# Altium schematic sheet Mechanical.SchDoc: Mechanical
size A; Organization: UCLA High Energy Physics; DocumentNumber: 23; Revision: 2.0; SheetNumber: 23; SheetTotal: 23; CurrentDate: 9/6/2018; ModifiedDate: 9/6/2018; ProjectName: ALCT S-6 Optical Mezzanine
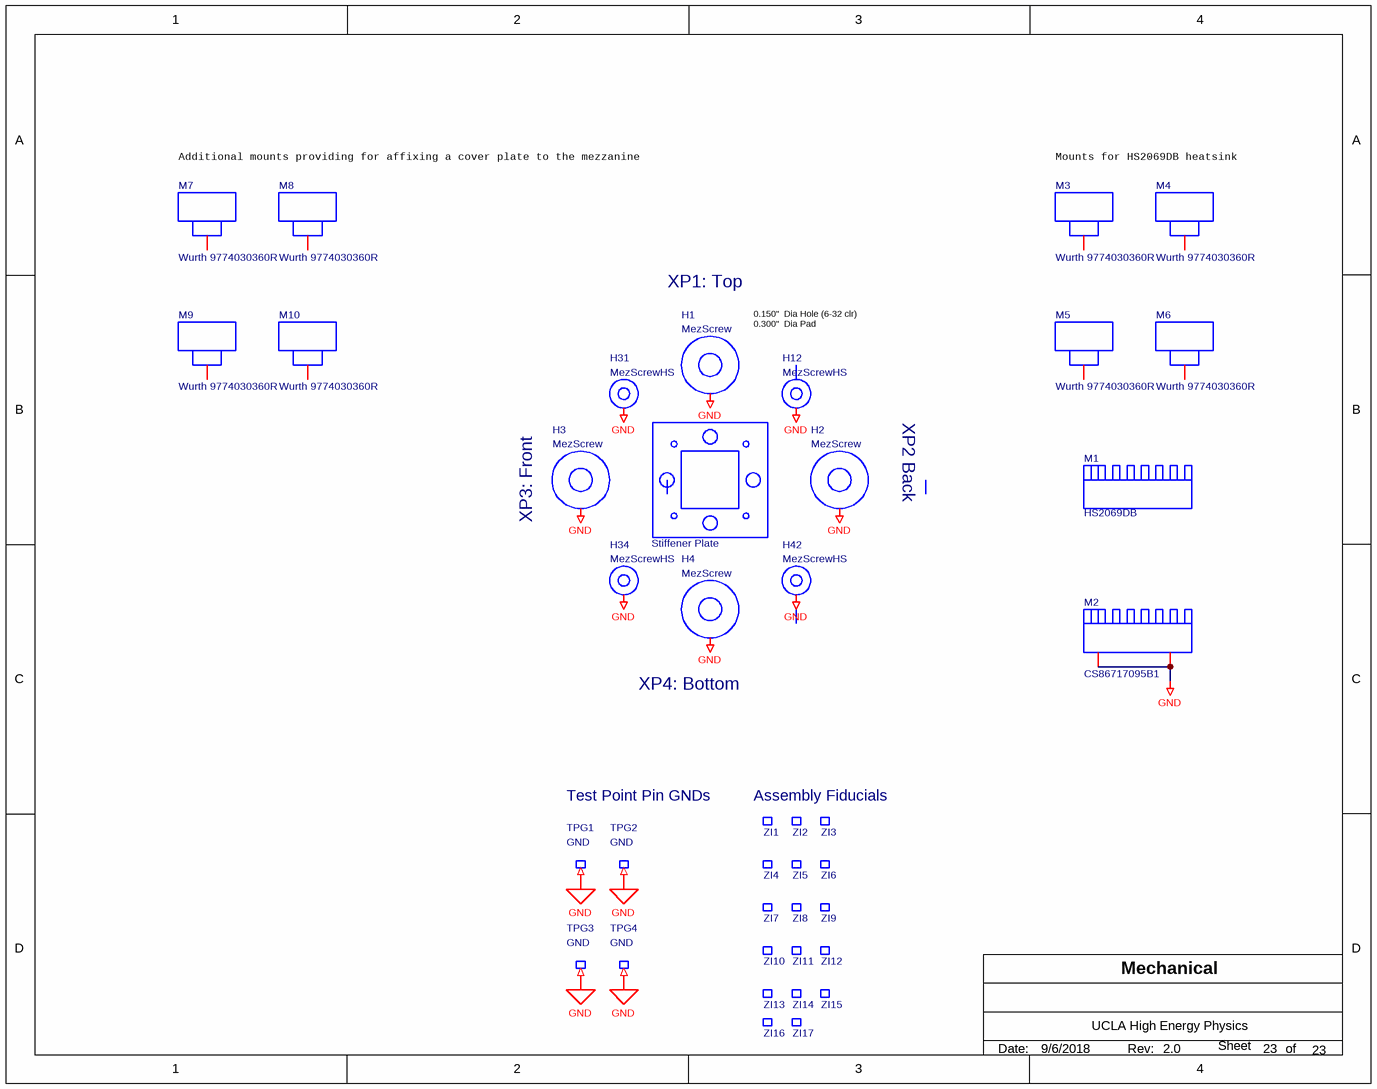
[diagram p0: Mechanical.SchDoc]

## Parts
H1  MezScrew  [MC_S6/TH/SCREW_BASE]  (no BOM)
H2  MezScrew  [MC_S6/TH/SCREW_BASE]  (no BOM)
H3  MezScrew  [MC_S6/TH/SCREW_BASE]  (no BOM)
H4  MezScrew  [MC_S6/TH/SCREW_BASE]  (no BOM)
H12  MezScrewHS  [MC_S6/TH/SCREW_PLATE]  (no BOM)
H31  MezScrewHS  [MC_S6/TH/SCREW_PLATE]  (no BOM)
H34  MezScrewHS  [MC_S6/TH/SCREW_PLATE]  (no BOM)
H42  MezScrewHS  [MC_S6/TH/SCREW_PLATE]  (no BOM)
M1  HS2069DB  [HS2069DB]  (no BOM)
M2  CS86717095B1  [CS86717095B1]  (no BOM)
M3  Wurth 9774030360R  [Wurth/9774020360R]
M4  Wurth 9774030360R  [Wurth/9774020360R]
M5  Wurth 9774030360R  [Wurth/9774020360R]
M6  Wurth 9774030360R  [Wurth/9774020360R]
M7  Wurth 9774030360R  [Wurth/9774020360R]
M8  Wurth 9774030360R  [Wurth/9774020360R]
M9  Wurth 9774030360R  [Wurth/9774020360R]
M10  Wurth 9774030360R  [Wurth/9774020360R]
SP1  Stiffener Plate  [MC_S6/SPLATE]  (no BOM)
TPG1  GND  [MC_S6/TH/TPGND]  (no BOM)
TPG2  GND  [MC_S6/TH/TPGND]  (no BOM)
TPG3  GND  [MC_S6/TH/TPGND]  (no BOM)
TPG4  GND  [MC_S6/TH/TPGND]  (no BOM)
ZI1  Fiducial Dot  [MC_S6/SM/FIDUCIAL_DOT]  (value not drawn)  (no BOM)
ZI2  Fiducial Dot  [MC_S6/SM/FIDUCIAL_DOT]  (value not drawn)  (no BOM)
ZI3  Fiducial Dot  [MC_S6/SM/FIDUCIAL_DOT]  (value not drawn)  (no BOM)
ZI4  Fiducial Dot  [MC_S6/SM/FIDUCIAL_DOT]  (value not drawn)  (no BOM)
ZI5  Fiducial Dot  [MC_S6/SM/FIDUCIAL_DOT]  (value not drawn)  (no BOM)
ZI6  Fiducial Dot  [MC_S6/SM/FIDUCIAL_DOT]  (value not drawn)  (no BOM)
ZI7  Fiducial Dot  [MC_S6/SM/FIDUCIAL_DOT]  (value not drawn)  (no BOM)
ZI8  Fiducial Dot  [MC_S6/SM/FIDUCIAL_DOT]  (value not drawn)  (no BOM)
ZI9  Fiducial Dot  [MC_S6/SM/FIDUCIAL_DOT]  (value not drawn)  (no BOM)
ZI10  Fiducial Dot  [MC_S6/SM/FIDUCIAL_DOT]  (value not drawn)  (no BOM)
ZI11  Fiducial Dot  [MC_S6/SM/FIDUCIAL_DOT]  (value not drawn)  (no BOM)
ZI12  Fiducial Dot  [MC_S6/SM/FIDUCIAL_DOT]  (value not drawn)  (no BOM)
ZI13  Fiducial Dot  [MC_S6/SM/FIDUCIAL_DOT]  (value not drawn)  (no BOM)
ZI14  Fiducial Dot  [MC_S6/SM/FIDUCIAL_DOT]  (value not drawn)  (no BOM)
ZI15  Fiducial Dot  [MC_S6/SM/FIDUCIAL_DOT]  (value not drawn)  (no BOM)
ZI16  Fiducial Dot  [MC_S6/SM/FIDUCIAL_DOT]  (value not drawn)  (no BOM)
ZI17  Fiducial Dot  [MC_S6/SM/FIDUCIAL_DOT]  (value not drawn)  (no BOM)

## Nets
GND: H1.1(GND) H2.1(GND) H3.1(GND) H4.1(GND) H12.1(GND) H31.1(GND) H34.1(GND) H42.1(GND) M2.1 M2.2 TPG1.1(In) TPG2.1(In) TPG3.1(In) TPG4.1(In)

Not connected (* = marked no-connect by the designer): M3 1; M4 1; M5 1; M6 1; M7 1; M8 1; M9 1; M10 1; ZI1 1(NC); ZI2 1(NC); ZI3 1(NC); ZI4 1(NC); ZI5 1(NC); ZI6 1(NC); ZI7 1(NC); ZI8 1(NC); ZI9 1(NC); ZI10 1(NC); ZI11 1(NC); ZI12 1(NC); ZI13 1(NC); ZI14 1(NC); ZI15 1(NC); ZI16 1(NC); ZI17 1(NC)

## Notes on the sheet
- Additional mounts providing for affixing a cover plate to the mezzanine
- Mounts for HS2069DB heatsink
- XP1: Top
- 0.150"  Dia Hole (6-32 clr)
  0.300"  Dia Pad
- XP2 Back
- (near H3) XP3: Front
- (near H4) XP4: Bottom
- Test Point Pin GNDs
- Assembly Fiducials
- Date:
- Rev:
- of
- Sheet

## Library data of the parts
H1-H4 = MezScrew: COMPSIDE: TOP; COMPGROUP: 0; mfgr_id: 92949A146; mfgr: McMaster; mfgr_foot: 6-32 ButtonSkt; COMPROT: 0
H12 H31 H34 H42 = MezScrewHS: mfgr_foot: 6-32 ButtonSkt; mfgr: McMaster; mfgr_id: 92949A146; COMPROT: 0; COMPSIDE: TOP; COMPGROUP: 0
M1 = HS2069DB: Heatsink 61 x 58 x 12mm
M2 = CS86717095B1: Heatsink 17 x 17 x 9.5mm
M3-M10 = Wurth/9774030360R: 9774030360R 3mm SMD Standoff; Manufacturer: Wurth Electronics; Plating: Tin; Threaded/Unthreaded: Threaded; Outside Diameter: 0.236inch; Thread Size: M3; Supplier 1: Digi-Key; Manufacturer Part Number: 9774030360R; Stock 1: 18011; Pricing 1: 1=1.65, 10=1.523, 50=1.411, 100=1.21 (USD); Mount: External; Case/Package: SMD/SMT; Material: Steel; Length: 0.173inch; Width: 6mm; REACH SVHC: Unknown; Lead Free: Lead Free; ComponentLink1URL: https://datasheet.ciiva.com/46421/1849514-46421897.pdf; ComponentLink1Description: https://datasheet.ciiva.com/46421/1849514-46421897.pdf; Supplier Part Number 1: 732-5270-6-ND
SP1 = SPlate_MC_S6
TPG1-TPG4 = TPGND: mfgr_id: 2341; mfgr: Mill-Max; mfgr_foot: Turret; silk: What; COMPROT: 0; COMPSIDE: TOP; Package: 90; COMPGROUP: 0
ZI1-ZI17 = Fiducial_dot: mfgr_foot: FID; mfgr: Layout; COMPROT: 0; COMPSIDE: TOP; mfgr_id: FID; Package: 90; COMPGROUP: 0